# EAGLE design S4 MAF Adapter (EAGLE 9.6.2)
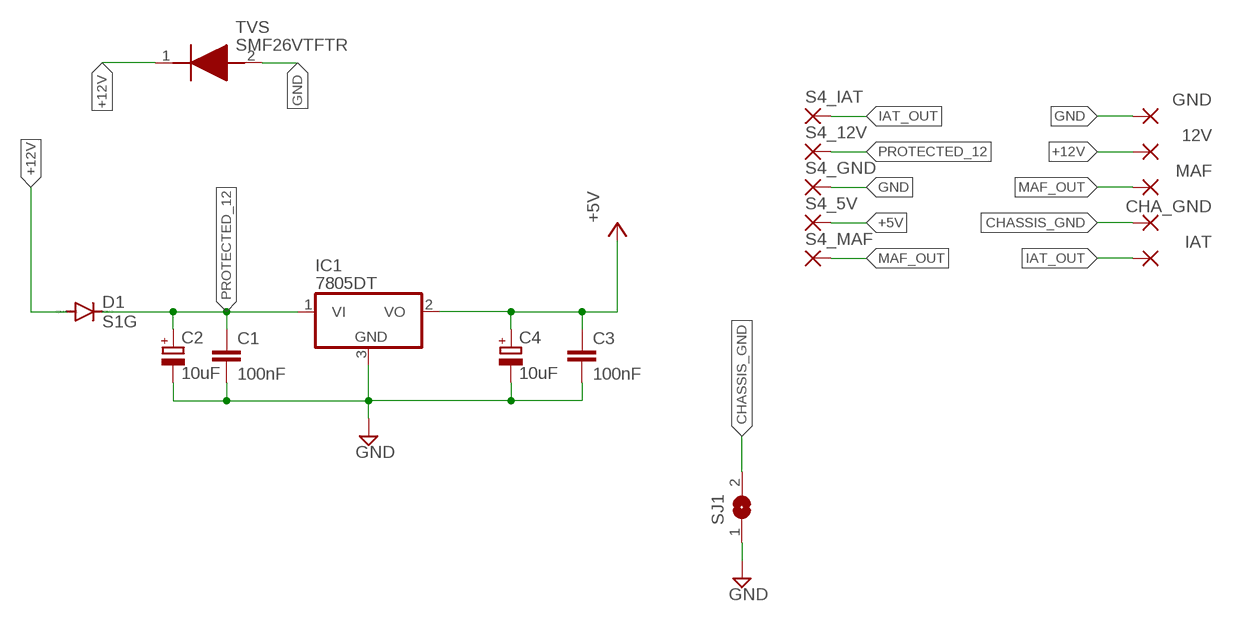
[diagram p0: schematic, sheet 1]

## Parts
12V  2,54/1,1  [2,54/1,1]
C1  100nF  C-EUC0805  [C0805]
C2  10uF  CPOL-EUE2-5  [E2-5]
C3  100nF  C-EUC0805  [C0805]
C4  10uF  CPOL-EUE2-5  [E2-5]
CHA_GND  2,54/1,1  [2,54/1,1]
D1  S1G  DIODE-DO-214AC  [DO-214AC]
GND  2,54/1,1  [2,54/1,1]
IAT  2,54/1,1  [2,54/1,1]
IC1  7805DT  [TO252]
MAF  2,54/1,1  [2,54/1,1]
S4_5V  2,54/1,1  [2,54/1,1]
S4_12V  2,54/1,1  [2,54/1,1]
S4_GND  2,54/1,1  [2,54/1,1]
S4_IAT  2,54/1,1  [2,54/1,1]
S4_MAF  2,54/1,1  [2,54/1,1]
SJ1  SJ  [SJ]
TVS  SMF26VTFTR  [SMF26VTFTR]

## Nets
+5V: C3.1 C4.+ IC1.2(VO) S4_5V.1(P)
+12V: 12V.1(P) D1.A TVS.1(K)
CHASSIS_GND: CHA_GND.1(P) SJ1.2
GND: C1.2 C2.- C3.2 C4.- GND.1(P) IC1.3(GND) S4_GND.1(P) SJ1.1 TVS.2(A)
IAT_OUT: IAT.1(P) S4_IAT.1(P)
MAF_OUT: MAF.1(P) S4_MAF.1(P)
PROTECTED_12: C1.1 C2.+ D1.C IC1.1(VI) S4_12V.1(P)

## Library data of the parts
12V CHA_GND GND IAT MAF S4_5V S4_12V S4_GND S4_IAT S4_MAF = wirepad:2,54/1,1: THROUGH-HOLE PAD
C1 C3 = rcl:C-EU: CAPACITOR, European symbol; SPICEPREFIX: C
C2 C4 = rcl:CPOL-EU: POLARIZED CAPACITOR, European symbol; SPICEPREFIX: C
D1 = diode:DIODE-: DIODE
IC1 = linear:78*: Positive VOLTAGE REGULATOR Source: http://cache.national.com/ds/LM/LM78L05.pdf http://www.fairchildsemi.com/ds/LM/LM7805.pdf
SJ1 = jumper:SJ: SMD solder JUMPER
TVS = SMF26VTFTR:SMF26VTFTR: Transient Voltage Suppressor (AEC-Q101 Qualified) Source: Datasheet <https://fscdn.rohm.com/en/products/databook/datasheet/discrete/diode/zener/smf26vtftr-e.pdf>; DESCRIPTION: Transient Voltage Suppressor (AEC-Q101 Qualified); HEIGHT: 0.9mm; MANUFACTURER_NAME: ROHM Semiconductor; MANUFACTURER_PART_NUMBER: SMF26VTFTR; MOUSER_PART_NUMBER: 755-SMF26VTFTR; MOUSER_PRICE-STOCK: https://www.mouser.co.uk/ProductDetail/ROHM-Semiconductor/SMF26VTFTR?qs=HXFqYaX1Q2zSWViY1YLSPg%3D%3D

## Board
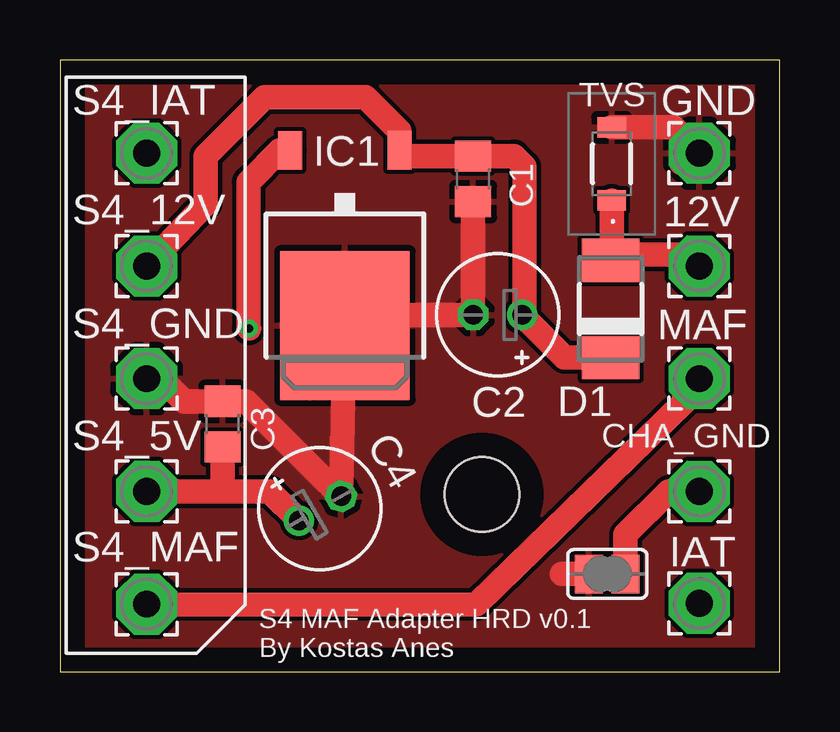
[diagram p1: board, top side]
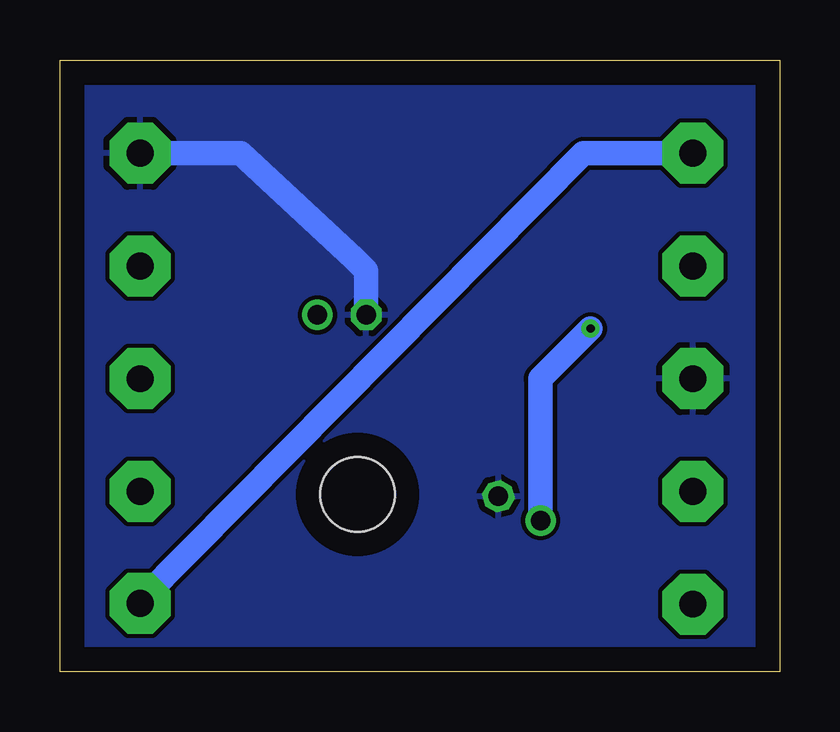
[diagram p2: board, bottom side, seen from below]

Size 30 x 25.5 mm. Coordinates in mm from the lower left corner, seen from the top.
Outline: 0,0 30,0 30,25.5 0,25.5 0,0
Copper layers (1*16): Top 0.035mm / dielectric 1.5mm / Bottom 0.035mm
Design rules "default *": minimum track width 6mil, minimum drill 0.35mm, track to track 7mil, track to pad 6mil, pad to pad 6mil, via to via 6mil, smd to smd 6mil, copper to edge 40mil, drill to drill 6mil, minimum pad ring 1mil, minimum via ring 8mil, stop-mask expansion 4mil, vias tented up to drill 0mil, thermal gap 10mil
Holes 3.1 mm at 17.59,7.38

### Footprints (pad centres in the part's own frame; a part is rotated, then mirrored left to right if it is on the bottom)
2,54/1,1 = drill 1.118 pad 2.54 octagon: 1 0,0
C0805 = smd 1.3 x 1.5: 1 -0.95,0; 2 0.95,0
E2-5 = drill 0.813 pad 1.27: + -1.016,0 | drill 0.813 pad 1.27 octagon: - 1.016,0
DO-214AC = smd 1.8 x 2.4: A 2.025,0; C -2.025,0
TO252 = smd 1 x 1.6: 1 -2.28,-4.8; 2 2.28,-4.8 | smd 5.4 x 6.2: 3 0,2.5
SJ = smd 1.168 x 1.6: 1 -0.762,0; 2 0.762,0
SMF26VTFTR = smd 1.2 x 0.85: 1 0,1.525; 2 0,-1.525

### Placement (x,y rotation side)
12V  26.66,16.91 0 top
C1  17.22,20.54 270 top
C2  18.25,14.87 180 top
C3  6.78,10.32 90 top
C4  10.84,6.8 30 top
CHA_GND  26.66,7.51 0 top
D1  22.96,15.12 90 top
GND  26.66,21.61 0 top
IAT  26.66,2.84 0 top
IC1  11.88,16.93 180 top
MAF  26.66,12.21 0 top
S4_5V  3.61,7.51 0 top
S4_12V  3.61,16.91 0 top
S4_GND  3.61,12.21 0 top
S4_IAT  3.61,21.61 0 top
S4_MAF  3.61,2.81 0 top
SJ1  22.82,4.07 0 top
TVS  23,21.17 180 top

### Tracks (layer width: path | path; a pad name or v marks a point on that pad's centre or on a via)
+5V  (via drill 0.35)
  Top 1.016: C3.1 6.78,7.68 6.61,7.51 | S4_5V.1 6.61,7.51 | 6.61,7.51 8.6,7.51 8.59,7.51 8.74,7.51 C4.+ | IC1.2 9.18,21.73 7.86,20.41 7.86,14.32 v7.88,14.3
  Bottom 1.016: v7.88,14.3 9.97,12.21 9.97,6.3 C4.+
+12V
  Top 1.016: D1.A 23.56,17.14 23.31,17.39 | 23.31,17.39 26.49,17.39 12V.1 | TVS.1 23,17.7 23.31,17.39
CHASSIS_GND
  Top 1.016: CHA_GND.1 25.38,7.51 23.58,5.71 SJ1.2
GND
  Top 1.016: 25.91,21.2 GND.1 25.57,22.7 TVS.2 | 10.43,11.81 13.49,14.87 C2.- 17.22,14.88 C1.2 | S4_GND.1 3.92,12.53 5.18,11.27 C3.2 7.75,11.27 C4.- 11.87,14.41 IC1.3 | SJ1.1 20.93,4.07 20.92,4.08
  Bottom 1.016: GND.1 22.46,21.61 17.73,17.21 17.23,16.71 C2.-
  pour Top: -0.93,26.66 -0.93,-0.38 0.58,-1.89 29.65,-1.89 30.95,-0.59 30.95,24.92 29.06,26.81 -0.78,26.81
  pour Bottom: -1.77,25.84 -1.77,-0.55 -0.26,-2.06 29.81,-2.06 31.45,-0.42 31.99,0.12 31.99,24.14 31.99,25.2 29.87,27.32 0.54,27.32 -0.03,26.75 -0.86,26.75
IAT_OUT
  Bottom 1.016: IAT.1 26.66,2.94 8.17,21.61 S4_IAT.1
MAF_OUT
  Top 1.016: MAF.1 26.04,12.21 26.04,11.24 17.35,2.8 3.65,2.77 S4_MAF.1
PROTECTED_12
  Top 1.016: D1.C 21.04,13.1 C2.+ 19.37,14.97 19.37,21.05 18.93,21.49 C1.1 14.4,21.49 IC1.1 14.16,22.53 12.74,23.95 8.54,23.95 6.08,21.5 6.08,19.48 S4_12V.1

### Text on the board
tNames: S4 MAF Adapter HRD v0.1 / By Kostas Anes